# Altium project loz-old-man.PrjPcb (part 3 of 5)

## Sheet POWER.SchDoc
size B; DocumentNumber: 2; SheetNumber: 2; SheetTotal: 14; PAGE_TITLE: -
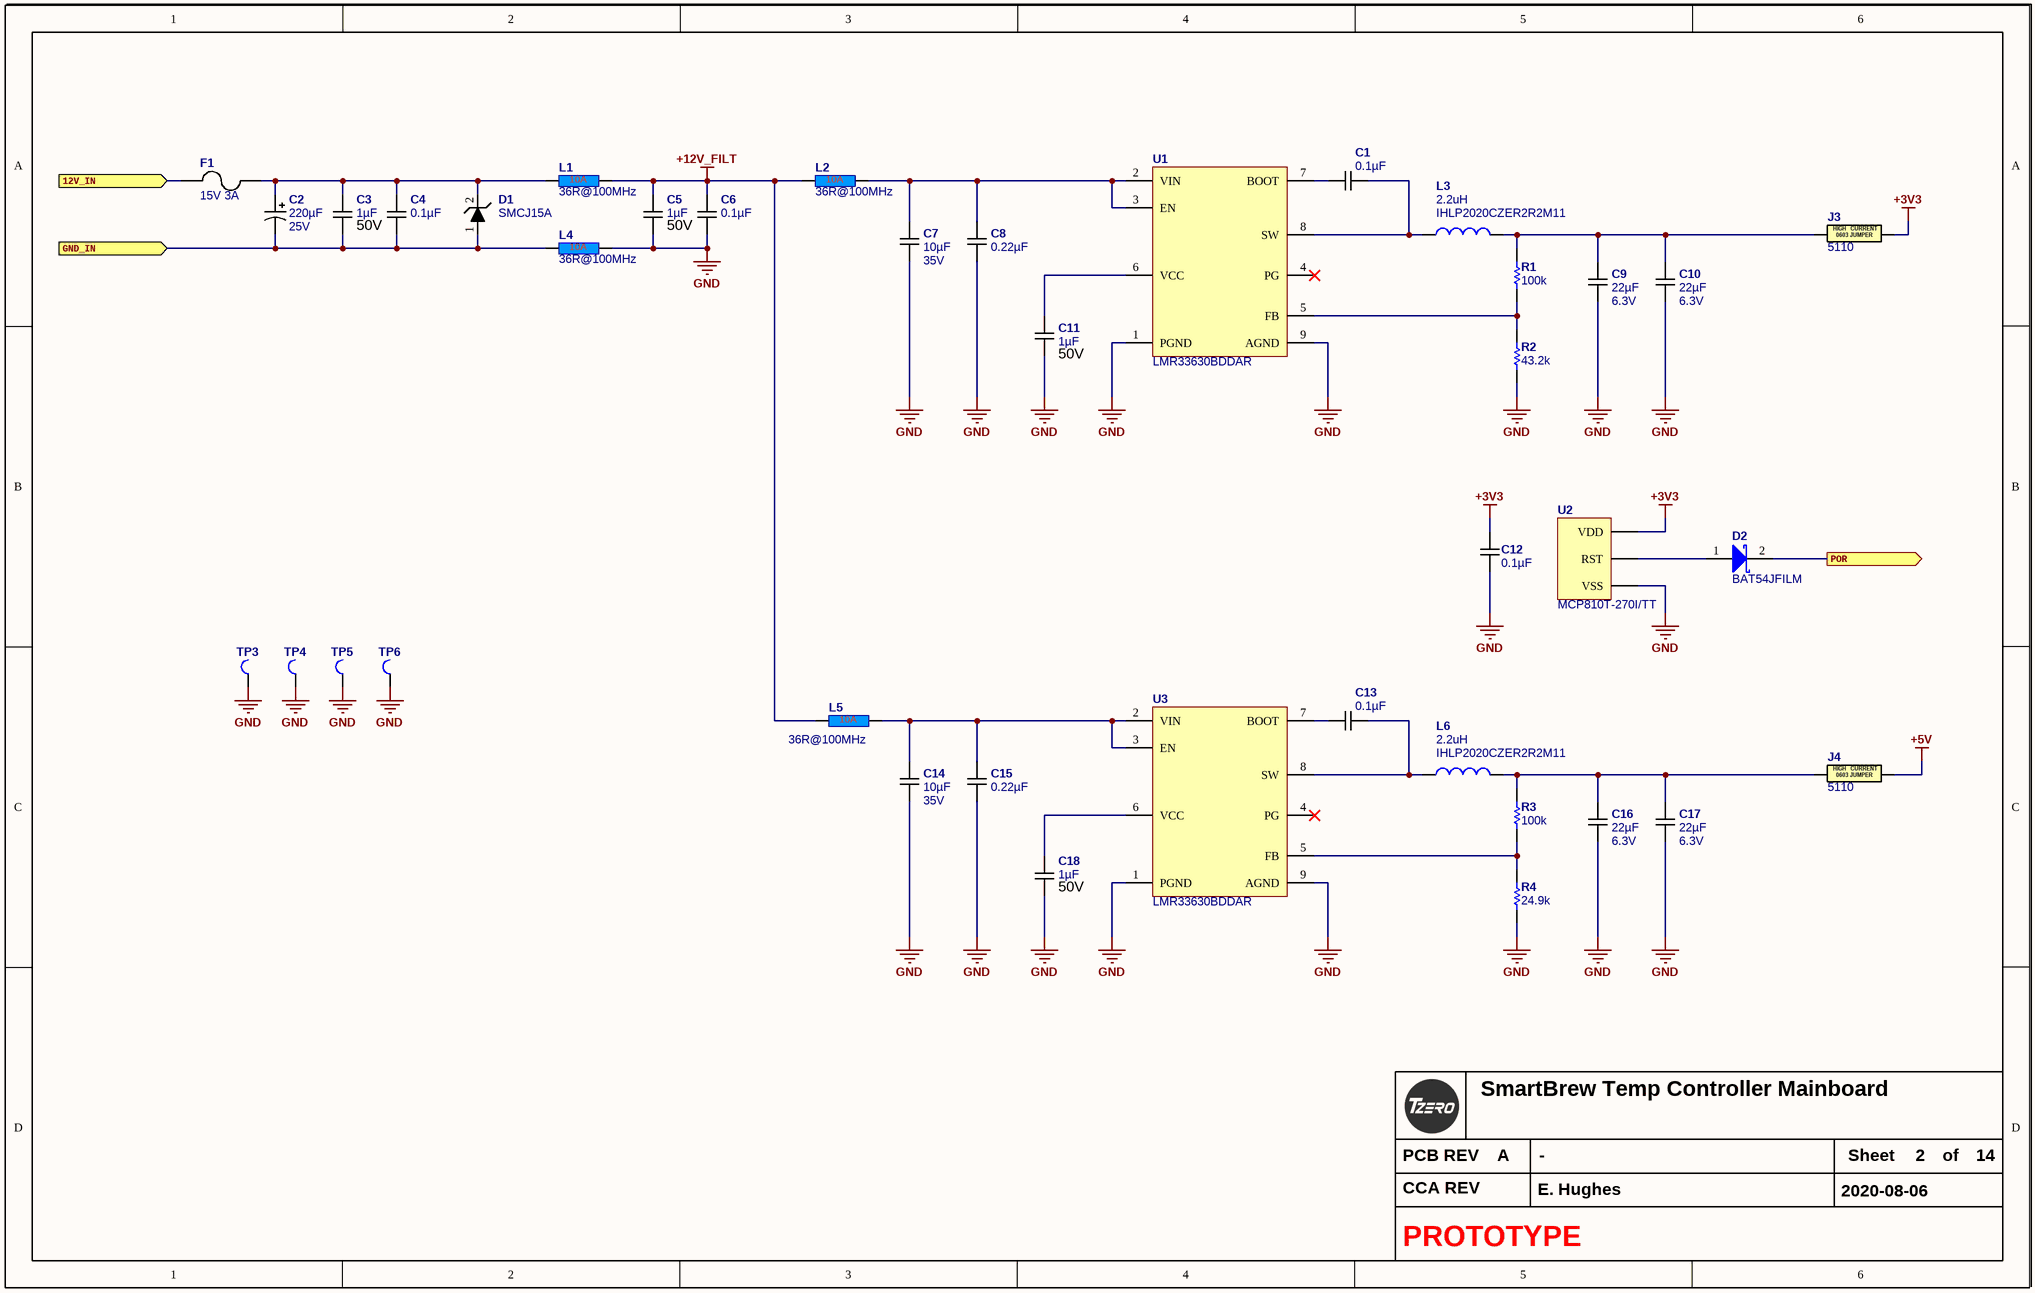
[diagram p6: POWER.SchDoc]

### Parts
C1  0.1µF  [C0402_0.55MM_HD]
C2  220µF  Voltage Rating: 25V  [C_ALU_F]
C3  1µF  Voltage - Rated: 50V  [C0805_1.50MM_MD]
C4  0.1µF  [C0402_0.55MM_HD]
C5  1µF  Voltage - Rated: 50V  [C0805_1.50MM_MD]
C6  0.1µF  [C0402_0.55MM_HD]
C7  10µF  Voltage - Rated: 35V  [C1206_1.90MM_HD]
C8  0.22µF  [C0603_0.90MM_HD]
C9  22µF  Voltage - Rated: 6.3V  [C1206_1.60MM_HD]
C10  22µF  Voltage - Rated: 6.3V  [C1206_1.60MM_HD]
C11  1µF  Voltage - Rated: 50V  [C0805_1.50MM_MD]
C12  0.1µF  [C0402_0.55MM_HD]
C13  0.1µF  [C0402_0.55MM_HD]
C14  10µF  Voltage - Rated: 35V  [C1206_1.90MM_HD]
C15  0.22µF  [C0603_0.90MM_HD]
C16  22µF  Voltage - Rated: 6.3V  [C1206_1.60MM_HD]
C17  22µF  Voltage - Rated: 6.3V  [C1206_1.60MM_HD]
C18  1µF  Voltage - Rated: 50V  [C0805_1.50MM_MD]
D1  SMCJ15A  [D_SMC_P]
D2  BAT54JFILM  [SOD-323]
F1  15V 3A  [F_PTC_2920]
J3  5110  [C0603_0.9mm]
J4  5110  [C0603_0.9mm]
L1  36R@100MHz  [T_Laird_35F0121-0SR-10]
L2  36R@100MHz  [T_Laird_35F0121-0SR-10]
L3  2.2uH  [IHLP-2020CZ]
L4  36R@100MHz  [T_Laird_35F0121-0SR-10]
L5  36R@100MHz  [T_Laird_35F0121-0SR-10]
L6  2.2uH  [IHLP-2020CZ]
R1  100k  [R0603_0.55MM_MD]
R2  43.2k  [R0603_0.55MM_MD]
R3  100k  [R0603_0.55MM_MD]
R4  24.9k  [R0603_0.55MM_MD]
TP3  PC TEST POINT MINIATURE SMT  [SMT_TEST_5015]  (value not drawn)
TP4  PC TEST POINT MINIATURE SMT  [SMT_TEST_5015]  (value not drawn)
TP5  PC TEST POINT MINIATURE SMT  [SMT_TEST_5015]  (value not drawn)
TP6  PC TEST POINT MINIATURE SMT  [SMT_TEST_5015]  (value not drawn)
U1  LMR33630BDDAR  [HSOIC-8]
U2  MCP810T-270I/TT  [SOT23_Medium]
U3  LMR33630BDDAR  [HSOIC-8]

### Ports
12V_IN (in), GND_IN (in), POR (out)

### Nets
+3V3: C12.1 J3.2 U2.3(VDD)
+5V: J4.2
+12V_FILT: C5.2 C6.2 L1.2 L2.1 L5.1
GND: C5.1 C6.1 C7.1 C8.1 C9.1 C10.1 C11.1 C12.2 C14.1 C15.1 C16.1 C17.1 C18.1 L4.2 R2.1 R4.1 TP3.1 TP4.1 TP5.1 TP6.1 U1.1(PGND) U1.9(AGND) U2.1(VSS) U3.1(PGND) U3.9(AGND)
12V_IN: F1.1 ; port 12V_IN
GND_IN: C2.2 C3.1 C4.1 D1.1(A) L4.1 ; port GND_IN
POR: D2.2(K) ; port POR
NetC1_1: C1.1 L3.1 U1.8(SW)
NetC1_2: C1.2 U1.7(BOOT)
NetC2_1: C2.1 C3.2 C4.2 D1.2(K) F1.2 L1.1
NetC7_2: C7.2 C8.2 L2.2 U1.2(VIN) U1.3(EN)
NetC9_2: C9.2 C10.2 J3.1 L3.2 R1.2
NetC11_2: C11.2 U1.6(VCC)
NetC13_1: C13.1 L6.1 U3.8(SW)
NetC13_2: C13.2 U3.7(BOOT)
NetC14_2: C14.2 C15.2 L5.2 U3.2(VIN) U3.3(EN)
NetC16_2: C16.2 C17.2 J4.1 L6.2 R3.2
NetC18_2: C18.2 U3.6(VCC)
NetD2_1: D2.1(A) U2.2(RST)
NetR1_1: R1.1 R2.2 U1.5(FB)
NetR3_1: R3.1 R4.2 U3.5(FB)

Not connected (* = marked no-connect by the designer): U1 4(PG)*; U3 4(PG)*

### Notes on the sheet
- PCB REV
- Sheet
- of
- CCA REV
- (in symbol 5110) HIGH; CURRENT; 0603 JUMPER

### Library data of the parts
C1 C4 C6 C12 C13 = CGA2B3X7R1E104K050BB: CAP CER 0.1UF 25V X7R 0402; Manufacturer: TDK Corporation; Tolerance: ±10%; Substitution Notes: 0.1µF , 25V , ±10% , X7R , -55°C ~ 125°C , AEC-Q200 , 0402; Value: 0.1µF; Temperature Coefficient: X7R; Manufacturer Part Number: CGA2B3X7R1E104K050BB; ComponentLink1Description: Datasheet (Internal); ComponentLink1URL: datasheets\TDK\mlcc_automotive_general_en.pdf; ComponentLink2Description: Datasheet (External); ComponentLink2URL: https://product.tdk.com/info/en/catalog/datasheets/mlcc_automotive_general_en.pdf; Supplier 1: Digikey; Supplier Part Number 1: 445-6902-1-ND; Category: Capacitors; Voltage - Rated: 25V; Features: -; Operating Temperature: -55°C ~ 125°C; Ratings: AEC-Q200; Package: 0402; Thickness (Max): 0.55MM
C2 = EEE-FK1E221P: CAP ALUM 220UF 25V 20% SMD; Manufacturer: Panasonic Electronic Components; Lifetime @ Temp#: 2000 Hrs @ 105°C; Ripple Current: 600mA; Impedance: 160 mOhm; Surface Mount Land Size: 0.327" L x 0.327" W (8.30mm x 8.30mm); Value_Voltage: 220µF  25V; Value: 220µF; Temperature Coefficient: Temperature Coefficient; Manufacturer Part Number: EEE-FK1E221P; ComponentLink1Description: Internal Datasheet; ComponentLink1URL: http://industrial.panasonic.com/www-cgi/jvcr13pz.cgi?E+PZ+3+ABA0120+EEEFK1E221P+7+WW; ComponentLink2Description: External Datasheet; ComponentLink2URL: http://industrial.panasonic.com/www-cgi/jvcr13pz.cgi?E+PZ+3+ABA0120+EEEFK1E221P+7+WW; Supplier 1: Digi-Key; Supplier Part Number 1: PCE3800CT-ND; Category: Capacitors; Sort Value: 220000000; Sort Value Package: F_220000000; Capacitance: 220µF; Tolerance: ±20%; Operating Temperature: -55°C ~ 105°C; Features: General Purpose; ESR (Equivalent Series Resistance): -; Mounting Type: Surface Mount; Package / Case: Radial- Can - SMD; Size / Dimension: 0.315" Dia (8.00mm); Height - Seated (Max): 0.402" (10.20mm); Lead Spacing: -; Packaging: Cut Tape (CT); Diameter: 8.00; Height: 10.20; Package: F; Ratings: AEC-Q200
C3 C5 C11 C18 = CGA4J3X7R1H105M125AE: CAP CER 1UF 50V X7R 0805; Manufacturer: TDK Corporation; Tolerance: ±20%; Substitution Notes: 1µF , 50V , ±20% , X7R , -55°C ~ 125°C , AEC-Q200 , 0805; Value: 1µF; Temperature Coefficient: X7R; Manufacturer Part Number: CGA4J3X7R1H105M125AE; ComponentLink1Description: Datasheet (Internal); ComponentLink1URL: datasheets\TDK\mlcc_automotive_general_en.pdf; ComponentLink2Description: Datasheet (External); ComponentLink2URL: https://product.tdk.com/info/en/catalog/datasheets/mlcc_automotive_general_en.pdf; Supplier 1: Digikey; Supplier Part Number 1: 445-7958-1-ND; Category: Capacitors; Features: Soft Termination; Operating Temperature: -55°C ~ 125°C; Ratings: AEC-Q200; Package: 0805; Thickness (Max): 1.50MM
C7 C14 = CGA5L1X7R1V106M160AE: CAP CER 10UF 35V X7R 1206; Manufacturer: TDK Corporation; Tolerance: ±20%; Substitution Notes: 10µF , 35V , ±20% , X7R ,  , AEC-Q200 , 1206; Value: 10µF; Temperature Coefficient: X7R; Manufacturer Part Number: CGA5L1X7R1V106M160AE; ComponentLink1Description: Datasheet (Internal); ComponentLink1URL: datasheets\TDK\mlcc_automotive_general_en.pdf; ComponentLink2Description: Datasheet (External); ComponentLink2URL: https://product.tdk.com/info/en/catalog/datasheets/mlcc_automotive_general_en.pdf; Supplier 1: Digikey; Supplier Part Number 1: 445-172484-1-ND; Category: Capacitors; Features: Soft Termination; Ratings: AEC-Q200; Package: 1206; Thickness (Max): 1.90MM
C8 C15 = CGA3E3X7R1H224K080AB: CAP CER 0.22UF 50V X7R 0603; Manufacturer: TDK Corporation; Tolerance: ±10%; Substitution Notes: 0.22µF , 50V , ±10% , X7R , -55°C ~ 125°C , AEC-Q200 , 0603; Value: 0.22µF; Temperature Coefficient: X7R; Manufacturer Part Number: CGA3E3X7R1H224K080AB; ComponentLink1Description: Datasheet (Internal); ComponentLink1URL: datasheets\TDK\mlcc_automotive_general_en.pdf; ComponentLink2Description: Datasheet (External); ComponentLink2URL: https://product.tdk.com/info/en/catalog/datasheets/mlcc_automotive_general_en.pdf; Supplier 1: Digikey; Supplier Part Number 1: 445-6926-1-ND; Category: Capacitors; Voltage - Rated: 50V; Features: -; Operating Temperature: -55°C ~ 125°C; Ratings: AEC-Q200; Package: 0603; Thickness (Max): 0.90MM
C9 C10 C16 C17 = CGA5L1X7R0J226M160AC: CAP CER 22UF 6.3V X7R 1206; Manufacturer: TDK Corporation; Tolerance: ±20%; Substitution Notes: 22µF , 6.3V , ±20% , X7R , -55°C ~ 125°C , AEC-Q200 , 1206; Value: 22µF; Temperature Coefficient: X7R; Manufacturer Part Number: CGA5L1X7R0J226M160AC; ComponentLink1Description: Datasheet (Internal); ComponentLink1URL: datasheets\TDK\mlcc_automotive_general_en.pdf; ComponentLink2Description: Datasheet (External); ComponentLink2URL: https://product.tdk.com/info/en/catalog/datasheets/mlcc_automotive_general_en.pdf; Supplier 1: Digikey; Supplier Part Number 1: 445-7884-1-ND; Category: Capacitors; Features: -; Ratings: AEC-Q200; Package: 1206; Thickness (Max): 1.60MM; Operating Temperature: -55°C ~ 125°C
D1 = SMCJ15A: DIODE TVS 15V 1500W UNI 5% SMC; Manufacturer: Littelfuse Inc; CategorySort: 850; Voltage - Breakdown: 16.7V; Polarization: Unidirectional; Diode Suffix: 1A_2C; Category: Circuit Protection; Value: SMCJ15A; Manufacturer Part Number: SMCJ15A; ComponentLink1Description: Internal Datasheet; ComponentLink1URL: http://www.littelfuse.com/data/en/Data_Sheets/Littelfuse_TVS_Diode_SMCJ.pdf; ComponentLink2Description: External Datasheet; ComponentLink2URL: http://www.littelfuse.com/data/en/Data_Sheets/Littelfuse_TVS_Diode_SMCJ.pdf; Supplier 1: Digi-Key; Supplier Part Number 1: SMCJ15ALFCT-ND; SortValue: SMCJ15A; Voltage - Reverse Standoff (Typ): 15V; Power (Watts): 1500W; Mounting Type: Surface Mount; Package: DO-214AB- SMC; Supplier Device Package: SMC; Packaging: Cut Tape (CT)
D2 = BAT54JFILM: DIODE SCHOTTKY 40V 300MA SOD323; Manufacturer: STMicroelectronics; CategorySort: 400; Reverse Recovery Time: 5ns; Peak Non-Repetitive Surge Current: 1A; Element Configuration: Single; Forward Voltage: 900mV; Packaging 1: Tape and Reel; Max Reverse Leakage Current: 1uA; Peak Reverse Current: 100uA; Polarity: Standard; Voltage Rating (DC): 30V; Capacitance: 10pF; Category: Diodes; Value: BAT54JFILM; Supplier 1: Digi-Key; Supplier Part Number 1: 497-7163-1-ND; Manufacturer Part Number: BAT54JFILM; Stock 1: 46673; Pricing 1: 1=0.36000, 10=0.29200, 100=0.11960, 500=0.09978, 1000=0.06933 (USD); RoHS: Yes; Mount: Surface Mount; Case/Package: SC; Number of Pins: 2; Weight: 0.01lb; Contact Plating: Tin,Matte; Min Operating Temperature: -40°C; Max Operating Temperature: 150°C; Forward Current: 300mA; Max Repetitive Reverse Voltage (Vrrm): 40V; Max Surge Current: 1A; Package Quantity: 1; Recovery Time: 5ns; Average Rectified Current: 300mA; Max Forward Surge Current (Ifsm): 1A; Termination: SMD/SMT; Output Current: 300mA; Current Rating: 300mA; Max Reverse Voltage (DC): 40V; Length: 1.8mm; Height: 1.07mm; Width: 1.45mm; Radiation Hardening: No; REACH SVHC: No SVHC; Lead Free: Lead Free; ComponentLink1URL: https://datasheet.ciiva.com/1177/1689724-1177952.pdf?src-supplier=Element14; ComponentLink1Description: https://datasheet.ciiva.com/1177/1689724-1177952.pdf?src-supplier=Element14; ComponentLink2URL: https://datasheet.ciiva.com/1200/1689724-1200625.pdf?src-supplier=Farnell; ComponentLink2Description: https://datasheet.ciiva.com/1200/1689724-1200625.pdf?src-supplier=Farnell; ComponentLink3URL: https://datasheet.ciiva.com/1200/cd00001322-1200626.pdf?src-supplier=Farnell; ComponentLink3Description: https://datasheet.ciiva.com/1200/cd00001322-1200626.pdf?src-supplier=Farnell; ComponentLink4URL: https://datasheet.ciiva.com/15192/getdatasheetpartid-185078-15192983.pdf?src-supplier=Verical; ComponentLink4Description: https://datasheet.ciiva.com/15192/getdatasheetpartid-185078-15192983.pdf?src-supplier=Verical; ComponentLink5URL: https://datasheet.ciiva.com/915/cd00001322-915529.pdf?src-supplier=Digi-Key; ComponentLink5Description: https://datasheet.ciiva.com/915/cd00001322-915529.pdf?src-supplier=Digi-Key; ComponentLink6URL: https://datasheet.ciiva.com/25954/cd00001322-25954459.pdf?src-supplier=Avnet+Europe; ComponentLink6Description: https://datasheet.ciiva.com/25954/cd00001322-25954459.pdf?src-supplier=Avnet+Europe; ComponentLink7URL: https://datasheet.ciiva.com/1177/1689724-1177950.pdf?src-supplier=Element14; ComponentLink7Description: https://datasheet.ciiva.com/1177/1689724-1177950.pdf?src-supplier=Element14; ComponentLink8URL: https://datasheet.ciiva.com/915/cd00001322-915527.pdf?src-supplier=Digi-Key; ComponentLink8Description: https://datasheet.ciiva.com/915/cd00001322-915527.pdf?src-supplier=Digi-Key; ComponentLink9URL: https://datasheet.ciiva.com/915/cd00001322-915528.pdf?src-supplier=Digi-Key; ComponentLink9Description: https://datasheet.ciiva.com/915/cd00001322-915528.pdf?src-supplier=Digi-Key; ComponentLink10URL: https://datasheet.ciiva.com/1177/1689724-1177951.pdf?src-supplier=Element14; ComponentLink10Description: https://datasheet.ciiva.com/1177/1689724-1177951.pdf?src-supplier=Element14; ComponentLink11URL: https://datasheet.ciiva.com/7622/1689724-7622351.pdf?src-supplier=Element14; ComponentLink11Description: https://datasheet.ciiva.com/7622/1689724-7622351.pdf?src-supplier=Element14
F1 = 2920L300/15DR: PTC RESETTABLE 15V 3A SMD 2920; Manufacturer: Littelfuse Inc; CategorySort: 850; Current - Trip (It): 5A; Current - Max: 40A; R Min/Max: 0.015 ~ 0.048 Ohm; Time to Trip: 20s; Current Trip: 3; Value: 15V 3A; Sort Value: *; Category: Circuit Protection; Manufacturer Part Number: 2920L300/15DR; ComponentLink1Description: Internal Datasheet; ComponentLink1URL: http://www.littelfuse.com/data/en/Data_Sheets/Littelfuse_PTC_2920L.pdf; ComponentLink2Description: External Datasheet; ComponentLink2URL: http://www.littelfuse.com/data/en/Data_Sheets/Littelfuse_PTC_2920L.pdf; Supplier 1: Digi-Key; Supplier Part Number 1: F2875CT-ND; SortValue: 15_3; Current - Hold (Ih) (Max): 3A; Voltage - Max: 15V; Package: 2920 (7351 Metric)- Concave; Packaging: Cut Tape (CT); Footprint: 2920
J3 J4 = 5110: 0603 Solid High Current Jumper; Manufacturer: Keystone Electronics; Resistance (Ohms): 0.0; Power (Watts): 0.5W, 1/2W; Supplier 1: Digi-Key; Supplier Part Number 1: 36-5110CT-ND; Manufacturer Part Number: 5110; RoHS: RoHS Compliant; Category: 5110; Stock 1: 23484; Pricing 1: 1=0.41, 10=0.384, 50=0.28, 100=0.2691, 250=0.24164, 500=0.23066 (USD); Packaging: Cut Tape (CT); Tolerance: Jumper; Composition: Thick Film; Features: -; Temperature Coefficient: -; Operating Temperature: -; Package / Case: 0603 (1608 Metric); Supplier Device Package: 0603; Size / Dimension: 0.061" L x 0.033" W (1.55mm x 0.85mm); Height: 0.028" (0.70mm); Number of Terminations: 2; ComponentLink1URL: http://www.keyelco.com/product-pdf.cfm?p=14038; ComponentLink1Description: http://www.keyelco.com/product-pdf.cfm?p=14038; Value: 5110
L1 L2 L4 L5 = 35F0121-0SR-10: Power Supply FB 10A; Manufacturer Name: Laird; Manufacturer: Laird Steward; Tolerance: 25%; Core Material: Ferrite; Impedance: 41R; Resistance: 42R; Number of Lines: 1; DC Resistance (DCR): 0.75mR; Test Frequency: 100MHz; Frequency: 10MHz; Rating: 10A; Manufacturer Part No.: 35F0121-0SR-10; Supplier 1: Digi-Key; Supplier Part Number 1: 240-2520-1-ND; Manufacturer Part Number: 35F0121-0SR-10; Stock: 289479; Pricing: 1 = 0.29000, 10 = 0.22600, 25 = 0.18760, 50 = 0.16160, 100 = 0.14540, 250 = 0.12280, 500 = 0.10988, 1000 = 0.09371 (USD); Mount: Surface Mount; Case/Package: SMD/SMT; Weight: 0.00512oz; Case Code (Metric): 4131; Case Code (Imperial): 1612; Min Operating Temperature: -40°C; Max Operating Temperature: 125°C; Package Quantity: 2500; Packaging: Tape and Reel; Max Current Rating: 10A; Max DC Current: 10A; Termination: SMD/SMT; Length: 0.16inch; Height: 0.12inch; Width: 0.12inch; Depth: 3.05mm; Lead Free: Lead Free; ComponentLink1URL: http://lairdtech.thomasnet.com/Asset/35F0121-0SR-10-C-2-VP.pdf; ComponentLink1Description: http://lairdtech.thomasnet.com/Asset/35F0121-0SR-10-C-2-VP.pdf; ComponentLink2URL: http://datasheet.octopart.com/35F0121-0SR-10-Steward-datasheet-65778.pdf; ComponentLink2Description: http://datasheet.octopart.com/35F0121-0SR-10-Steward-datasheet-65778.pdf; ComponentLink3URL: http://datasheet.octopart.com/35F0121-0SR-10-Steward-datasheet-153820.pdf; ComponentLink3Description: http://datasheet.octopart.com/35F0121-0SR-10-Steward-datasheet-153820.pdf; ComponentLink4URL: http://datasheet.octopart.com/35F0121-0SR-10-Steward-datasheet-14434158.pdf; ComponentLink4Description: http://datasheet.octopart.com/35F0121-0SR-10-Steward-datasheet-14434158.pdf; Value: 36R@100MHz
L3 L6 = IHLP2020CZER2R2M11: FIXED IND 2.2UH 6.75A 25 MOHM; Manufacturer: Vishay Dale; CategorySort: 300; Core Material: Metal,Composite; Tolerance: 20%; DC Resistance (DCR): 25mR; Packaging 1: Tape and Reel; Saturation Current: 5.5A; Shielding: Shielded; Self Resonant Frequency: 41MHz; Test Frequency: 100kHz; Category: INDUCTOR; Value: 2.2uH; Supplier 1: Digi-Key; Supplier Part Number 1: 541-1236-1-ND; Manufacturer Part Number: IHLP2020CZER2R2M11; Stock 1: 63099; Pricing 1: 1=2.39000, 10=2.20800, 100=1.54560, 500=1.25120, 1000=1.14080 (USD); RoHS: Yes; Mount: Surface Mount; Case/Package: 2020; Contact Plating: Tin; Min Operating Temperature: -55°C; Max Operating Temperature: 125°C; Inductance: 2.2uH; Inductance Tolerance: 20%; Package Quantity: 2000; Current Rating: 6.75A; Max DC Current: 5.5A; Termination: SMD/SMT; RMS Current (Irms): 6.75A; Military Standard: Not; Length: 5.74mm; Height: 3mm; Depth: 5.43mm; Width: 0.204inch; Height - Seated (Max): 0.118inch; Radiation Hardening: No; REACH SVHC: Unknown; Lead Free: Lead Free; ComponentLink1URL: https://datasheet.ciiva.com/11798/0900766b8102c930-11798352.pdf?src-supplier=RSComponents; ComponentLink1Description: https://datasheet.ciiva.com/11798/0900766b8102c930-11798352.pdf?src-supplier=RSComponents; ComponentLink2URL: https://datasheet.ciiva.com/1051/lp20cz11-1051642.pdf?src-supplier=Digi-Key; ComponentLink2Description: https://datasheet.ciiva.com/1051/lp20cz11-1051642.pdf?src-supplier=Digi-Key; ComponentLink3URL: https://datasheet.ciiva.com/1051/lp20cz11-1051643.pdf?src-supplier=Digi-Key; ComponentLink3Description: https://datasheet.ciiva.com/1051/lp20cz11-1051643.pdf?src-supplier=Digi-Key; ComponentLink4URL: https://datasheet.ciiva.com/17269/lp20cz11-17269547.pdf?src-supplier=Avnet+Europe; ComponentLink4Description: https://datasheet.ciiva.com/17269/lp20cz11-17269547.pdf?src-supplier=Avnet+Europe; ComponentLink5URL: https://datasheet.ciiva.com/1051/lp20cz11-1051644.pdf?src-supplier=Digi-Key; ComponentLink5Description: https://datasheet.ciiva.com/1051/lp20cz11-1051644.pdf?src-supplier=Digi-Key; ComponentLink6URL: https://datasheet.ciiva.com/24205/lp20cz11-24205966.pdf?src-supplier=Future+Electronics; ComponentLink6Description: https://datasheet.ciiva.com/24205/lp20cz11-24205966.pdf?src-supplier=Future+Electronics; ComponentLink7URL: https://datasheet.ciiva.com/46385/480942-46385615.pdf?src-supplier=Element14; ComponentLink7Description: https://datasheet.ciiva.com/46385/480942-46385615.pdf?src-supplier=Element14
R1 R3 = ERJ-3EKF1003V: RES 100K OHM 1/10W 1% 0603 SMD; Manufacturer: Panasonic Electronic Components; Package Power: 0603  (0.1W); Power (Watts): 0.1W- 1/10W; Temperature Coefficient: ±100ppm/°C; Limiting Element Voltage: 75; Maximum Overload Voltage: 150; Maximum Working Voltage: 75.0V; Substitution Notes: 100k , ±1% , 0603 , AEC-Q200; Value: 100k; Manufacturer Part Number: ERJ-3EKF1003V; ComponentLink1Description: Internal Datasheet; ComponentLink1URL: datasheets\Panasonic Electronic Components\AOA0000CE2.pdf; ComponentLink2Description: External Datasheet; ComponentLink2URL: http://industrial.panasonic.com/www-data/pdf/AOA0000/AOA0000CE2.pdf; Supplier 1: Digi-Key; Supplier Part Number 1: P100KHCT-ND; Category: Resistors; Resistance (Ohms): 100k; Composition: Thick Film; Features: -; Tolerance: ±1%; Package: 0603 (1608 Metric); Supplier Package: 0603; Size / Dimension: 0.063" L x 0.031" W (1.60mm x 0.80mm); Height: 0.55MM; Number of Terminations: 2; Packaging: Cut Tape (CT); Sort Value: 100000; Sort Value Package: 603_100000; Ratings: AEC-Q200
R2 = ERJ-3EKF4322V: RES 43.2K OHM 1/10W 1% 0603 SMD; Manufacturer: Panasonic Electronic Components; Package Power: 0603  (0.1W); Power (Watts): 0.1W- 1/10W; Temperature Coefficient: ±100ppm/°C; Limiting Element Voltage: 75; Maximum Overload Voltage: 150; Maximum Working Voltage: 65.7V; Substitution Notes: 43.2k , ±1% , 0603 , AEC-Q200; Value: 43.2k; Manufacturer Part Number: ERJ-3EKF4322V; ComponentLink1Description: Internal Datasheet; ComponentLink1URL: datasheets\Panasonic Electronic Components\AOA0000CE2.pdf; ComponentLink2Description: External Datasheet; ComponentLink2URL: http://industrial.panasonic.com/www-data/pdf/AOA0000/AOA0000CE2.pdf; Supplier 1: Digi-Key; Supplier Part Number 1: P43.2KHCT-ND; Category: Resistors; Resistance (Ohms): 43.2k; Composition: Thick Film; Features: -; Tolerance: ±1%; Package: 0603 (1608 Metric); Supplier Package: 0603; Size / Dimension: 0.063" L x 0.031" W (1.60mm x 0.80mm); Height: 0.55MM; Number of Terminations: 2; Packaging: Cut Tape (CT); Sort Value: 43200; Sort Value Package: 603_43200; Ratings: AEC-Q200
R4 = ERJ-3EKF2492V: RES 24.9K OHM 1/10W 1% 0603 SMD; Manufacturer: Panasonic Electronic Components; Package Power: 0603  (0.1W); Power (Watts): 0.1W- 1/10W; Temperature Coefficient: ±100ppm/°C; Limiting Element Voltage: 75; Maximum Overload Voltage: 150; Maximum Working Voltage: 49.9V; Substitution Notes: 24.9k , ±1% , 0603 , AEC-Q200; Value: 24.9k; Manufacturer Part Number: ERJ-3EKF2492V; ComponentLink1Description: Internal Datasheet; ComponentLink1URL: datasheets\Panasonic Electronic Components\AOA0000CE2.pdf; ComponentLink2Description: External Datasheet; ComponentLink2URL: http://industrial.panasonic.com/www-data/pdf/AOA0000/AOA0000CE2.pdf; Supplier 1: Digi-Key; Supplier Part Number 1: P24.9KHCT-ND; Category: Resistors; Resistance (Ohms): 24.9k; Composition: Thick Film; Features: -; Tolerance: ±1%; Package: 0603 (1608 Metric); Supplier Package: 0603; Size / Dimension: 0.063" L x 0.031" W (1.60mm x 0.80mm); Height: 0.55MM; Number of Terminations: 2; Packaging: Cut Tape (CT); Sort Value: 24900; Sort Value Package: 603_24900; Ratings: AEC-Q200
TP3-TP6 = 5015: Manufacturer: Keystone Electronics; Manufacturer Part Number: 5015; ROHS Certificate: *; Value: PC TEST POINT MINIATURE SMT; Pricing: *; Supplier 1: Digi-Key; Supplier Part Number 1: 36-5015CT-ND; RoHS: RoHS Compliant; Category: Test and Measurement; Type: PC Test Point, Miniature; Terminal: 0.010" (0.25mm) Phosphor Bronze, Silver Plate; Mounting Type: Surface Mount; Material: Phosphor Bronze; Color: -; Packaging: Cut Tape (CT); ComponentLink1URL: http://mail.keyelco.com/ENG._DEPT/PDF%20CAT%20NO%20Drawings/5015.pdf; ComponentLink1Description: http://mail.keyelco.com/ENG._DEPT/PDF%20CAT%20NO%20Drawings/5015.pdf
U1 U3 = LMR33630BDDAR: SIMPLE SWITCHER® 3.8V to 36V, 3A Synchronous Buck Converter With Ultra-Low EMI 8-SO PowerPAD -40 to 125; Manufacturer: Texas Instruments; CategorySort: 600; Output Type: Adjustable; Packaging 1: Tape and Reel; Output Configuration: Positive; Number of Outputs: 1; Min Output Voltage: 1V; Max Output Voltage: 24V; Switching Frequency: 1.4MHz; Synchronous Rectifier: Yes; Category: Integrated Circuits; Value: LMR33630BDDAR; Supplier 1: Digi-Key; Supplier Part Number 1: 296-49765-1-ND; Manufacturer Part Number: LMR33630BDDAR; Stock 1: 1151; Pricing 1: 1=2.21000, 10=1.98800, 25=1.87520, 100=1.50000, 250=1.31252, 500=1.27500, 1000=1.01250 (USD); RoHS: No; Mount: Surface Mount; Number of Pins: 8; Min Operating Temperature: -40°C; Max Operating Temperature: 125°C; Min Input Voltage: 3.8V; Max Input Voltage: 36V; Output Current: 3A; ComponentLink1URL: http://www.ti.com/lit/ds/symlink/lmr33630.pdf?src-supplier=Digi-Key; ComponentLink1Description: http://www.ti.com/lit/ds/symlink/lmr33630.pdf?src-supplier=Digi-Key; ComponentLink2URL: http://www.ti.com/general/docs/suppproductinfo.tsp?distId=10&amp;gotoUrl=http%3A%2F%2Fwww.ti.com%2Flit%2Fgpn%2Flmr33630&src-supplier=Digi-Key; ComponentLink2Description: http://www.ti.com/general/docs/suppproductinfo.tsp?distId=10&amp;gotoUrl=http%3A%2F%2Fwww.ti.com%2Flit%2Fgpn%2Flmr33630&src-supplier=Digi-Key
U2 = MCP810T-270I/TT: IC SUPERVISOR 2.70V HIGH SOT23; Manufacturer: Microchip Technology; Number of Voltages Monitored: 1; Output: Push-Pull, Totem Pole; Reset: Active High; Reset Timeout: 150 ms Minimum; Voltage - Threshold: 2.625V; CategorySort: 600; Value: MCP810T-270I/TT; Sort Value: *; Category: Integrated Circuits; Supplier 1: Digi-Key; Supplier Part Number 1: MCP810T-270I/TTCT-ND; Manufacturer Part Number: MCP810T-270I/TT; RoHS: RoHS Compliant; Stock 1: 6831; Pricing 1: 1=0.54, 10=0.45, 25=0.37, 100=0.34 (USD); Type: Simple Reset/Power-On Reset; Operating Temperature: -40°C ~ 85°C; Mounting Type: Surface Mount; Package: SOT-23-3, TO-236-3, Micro3™, SSD3, SST3; Packaging: Cut Tape (CT); Supplier Device Package: *; ComponentLink1URL: http://ww1.microchip.com/downloads/en/DeviceDoc/11194c.pdf; ComponentLink1Description: http://ww1.microchip.com/downloads/en/DeviceDoc/11194c.pdf

## Sheet RAM.SchDoc
size B; Organization: Pyrotechnics Management Inc.; DocumentNumber: 10; SheetNumber: 10; SheetTotal: 14; PageSetup: Record=PageOptions|CenterHorizontal=True|CenterVertical=True|PrintScale=0.99|XCorrection=1.00|YCorrection=1.00|PrintKind=1|BorderSize=5000000|LeftOffset=0|BottomOffset=0|Orientation=2|PaperLength=1000|PaperWidth=1000|Scale=100|PaperSource=7|PrintQuality=-4|MediaType=1|DitherType=10|PaperKind=Tabloid (11 x 17")|PrintScaleMode=1; SCHEMATIC_SHEET_TITLE: RAM; PAGE_TITLE: -
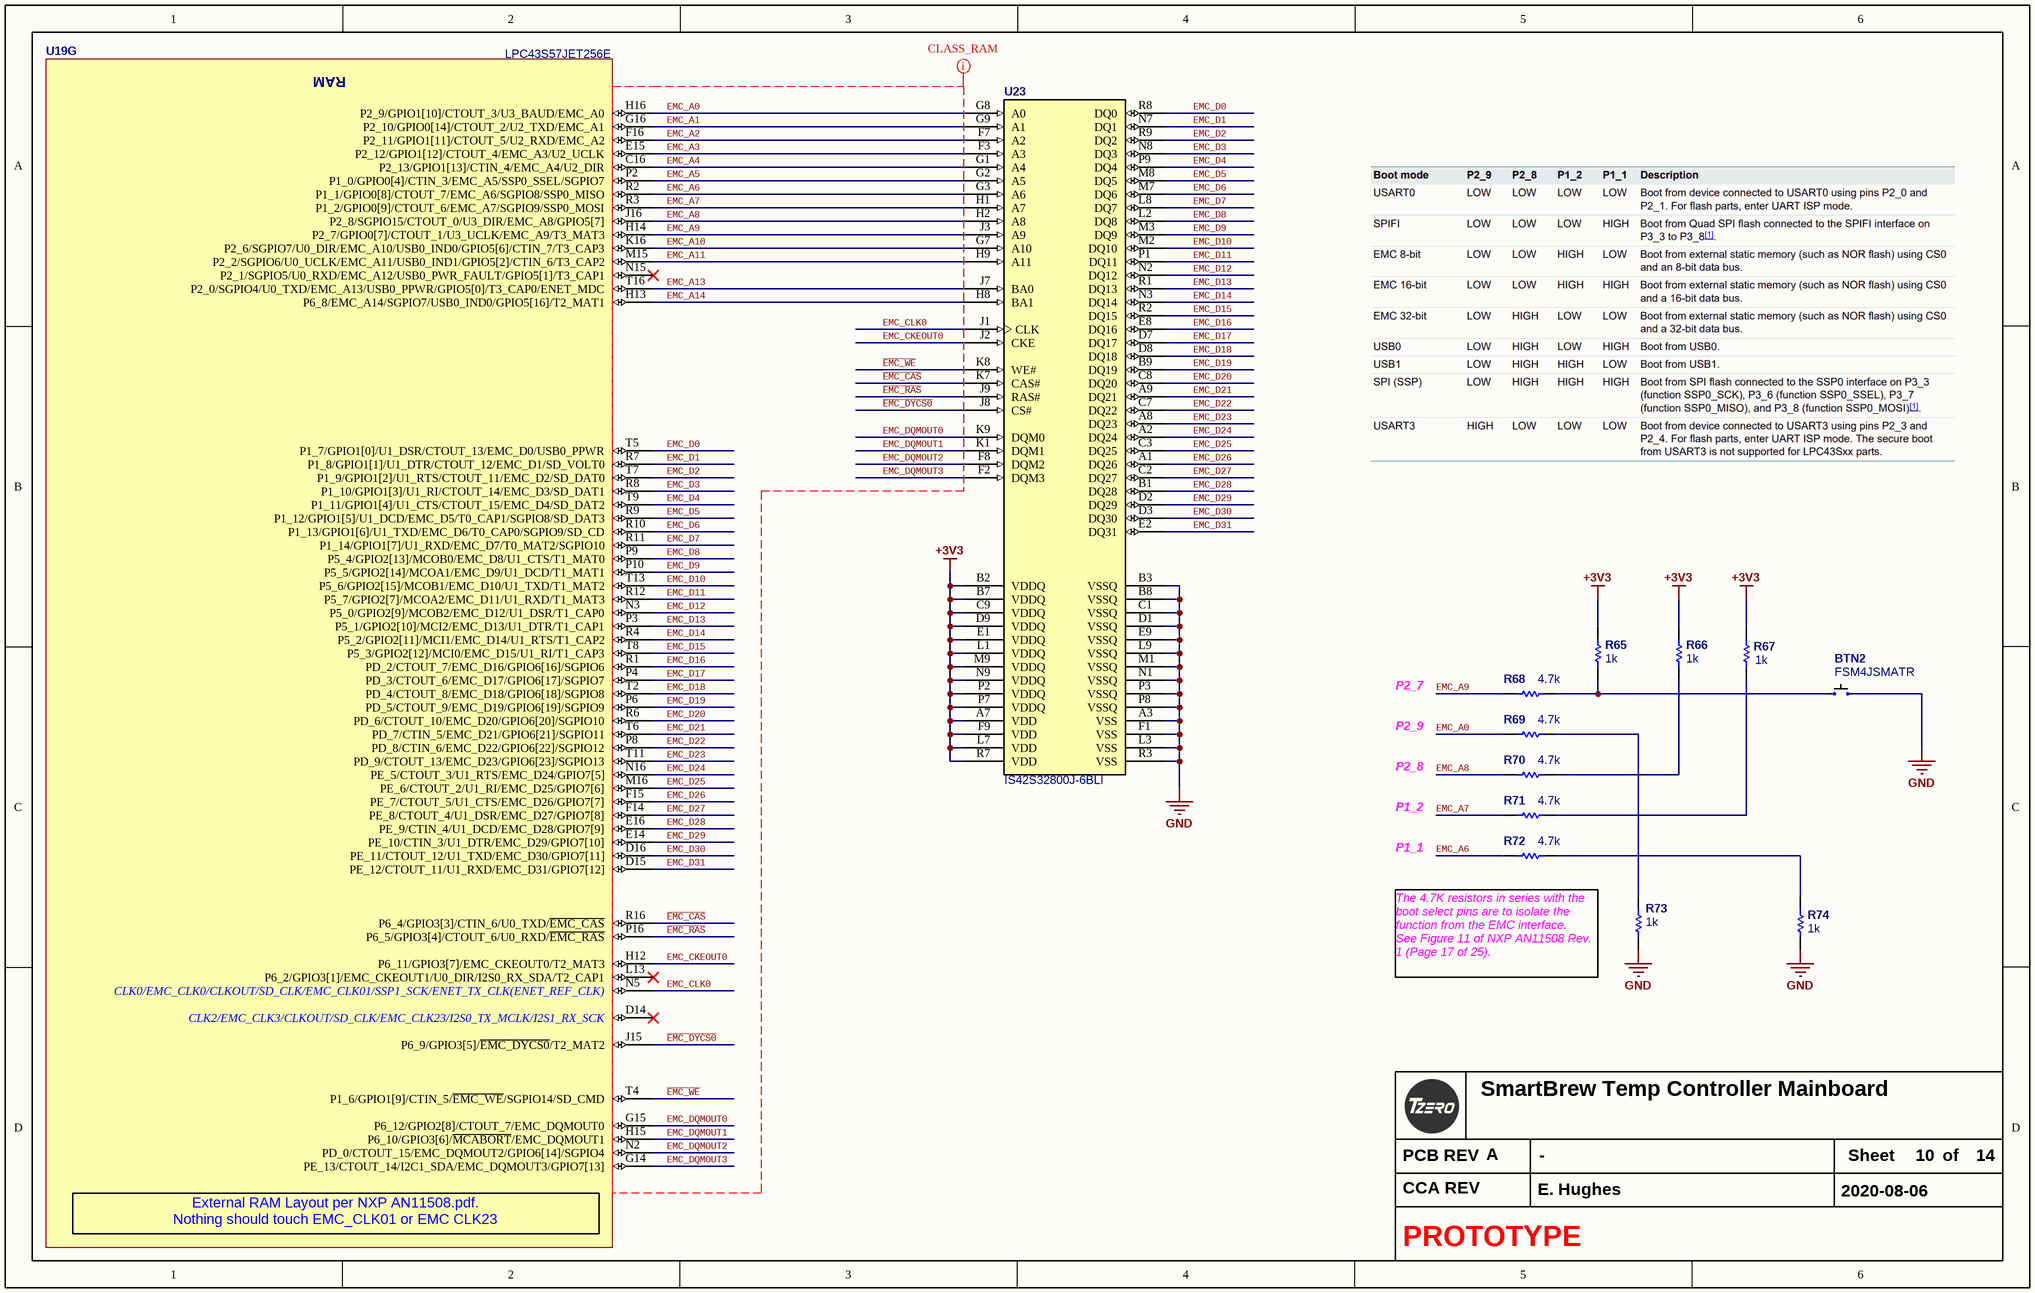
[diagram p7: RAM.SchDoc]

### Parts
BTN2  FSM4JSMATR  [FSM4JSMA]
R65  1k  [R0603_0.55MM_MD]
R66  1k  [R0603_0.55MM_MD]
R67  1k  [R0603_0.55MM_MD]
R68  4.7k  [R0603_0.55MM_MD]
R69  4.7k  [R0603_0.55MM_MD]
R70  4.7k  [R0603_0.55MM_MD]
R71  4.7k  [R0603_0.55MM_MD]
R72  4.7k  [R0603_0.55MM_MD]
R73  1k  [R0603_0.55MM_MD]
R74  1k  [R0603_0.55MM_MD]
U19  LPC43S57JET256E  [LBGA256 16X16 1700X1700X155]  (part G of 10)
U23  IS42S32800J-6BLI  [TFBGA90_8x13]

### Nets
+3V3: R65.2 R66.2 R67.2 U23.A7(VDD) U23.B2(VDDQ) U23.B7(VDDQ) U23.C9(VDDQ) U23.D9(VDDQ) U23.E1(VDDQ) U23.F9(VDD) U23.L1(VDDQ) U23.L7(VDD) U23.M9(VDDQ) U23.N9(VDDQ) U23.P2(VDDQ) U23.P7(VDDQ) U23.R7(VDD)
GND: BTN2.B R73.1 R74.1 U23.A3(VSS) U23.B3(VSSQ) U23.B8(VSSQ) U23.C1(VSSQ) U23.D1(VSSQ) U23.E9(VSSQ) U23.F1(VSS) U23.L3(VSS) U23.L9(VSSQ) U23.M1(VSSQ) U23.N1(VSSQ) U23.P3(VSSQ) U23.P8(VSSQ) U23.R3(VSS)
~{EMC_CAS}: U19.R16(P6_4/GPIO3[3]/CTIN_6/U0_TXD/~{EMC_CAS}) U23.K7(CAS#)
~{EMC_DYCS0}: U19.J15(P6_9/GPIO3[5]/~{EMC_DYCS0}/T2_MAT2) U23.J8(CS#)
~{EMC_RAS}: U19.P16(P6_5/GPIO3[4]/CTOUT_6/U0_RXD/~{EMC_RAS}) U23.J9(RAS#)
~{EMC_WE}: U19.T4(P1_6/GPIO1[9]/CTIN_5/~{EMC_WE}/SGPIO14/SD_CMD) U23.K8(WE#)
EMC_A0: R69.2 U19.H16(P2_9/GPIO1[10]/CTOUT_3/U3_BAUD/EMC_A0) U23.G8(A0)
EMC_A1: U19.G16(P2_10/GPIO0[14]/CTOUT_2/U2_TXD/EMC_A1) U23.G9(A1)
EMC_A2: U19.F16(P2_11/GPIO1[11]/CTOUT_5/U2_RXD/EMC_A2) U23.F7(A2)
EMC_A3: U19.E15(P2_12/GPIO1[12]/CTOUT_4/EMC_A3/U2_UCLK) U23.F3(A3)
EMC_A4: U19.C16(P2_13/GPIO1[13]/CTIN_4/EMC_A4/U2_DIR) U23.G1(A4)
EMC_A5: U19.P2(P1_0/GPIO0[4]/CTIN_3/EMC_A5/SSP0_SSEL/SGPIO7) U23.G2(A5)
EMC_A6: R72.2 U19.R2(P1_1/GPIO0[8]/CTOUT_7/EMC_A6/SGPIO8/SSP0_MISO) U23.G3(A6)
EMC_A7: R71.2 U19.R3(P1_2/GPIO0[9]/CTOUT_6/EMC_A7/SGPIO9/SSP0_MOSI) U23.H1(A7)
EMC_A8: R70.2 U19.J16(P2_8/SGPIO15/CTOUT_0/U3_DIR/EMC_A8/GPIO5[7]) U23.H2(A8)
EMC_A9: R68.2 U19.H14(P2_7/GPIO0[7]/CTOUT_1/U3_UCLK/EMC_A9/T3_MAT3) U23.J3(A9)
EMC_A10: U19.K16(P2_6/SGPIO7/U0_DIR/EMC_A10/USB0_IND0/GPIO5[6]/CTIN_7/T3_CAP3) U23.G7(A10)
EMC_A11: U19.M15(P2_2/SGPIO6/U0_UCLK/EMC_A11/USB0_IND1/GPIO5[2]/CTIN_6/T3_CAP2) U23.H9(A11)
EMC_A13: U19.T16(P2_0/SGPIO4/U0_TXD/EMC_A13/USB0_PPWR/GPIO5[0]/T3_CAP0/ENET_MDC) U23.J7(BA0)
EMC_A14: U19.H13(P6_8/EMC_A14/SGPIO7/USB0_IND0/GPIO5[16]/T2_MAT1) U23.H8(BA1)
EMC_CKEOUT0: U19.H12(P6_11/GPIO3[7]/EMC_CKEOUT0/T2_MAT3) U23.J2(CKE)
EMC_CLK0: U19.N5(CLK0/EMC_CLK0/CLKOUT/SD_CLK/EMC_CLK01/SSP1_SCK/ENET_TX_CLK(ENET_REF_CLK)) U23.J1(CLK)
EMC_D0: U19.T5(P1_7/GPIO1[0]/U1_DSR/CTOUT_13/EMC_D0/USB0_PPWR) U23.R8(DQ0)
EMC_D1: U19.R7(P1_8/GPIO1[1]/U1_DTR/CTOUT_12/EMC_D1/SD_VOLT0) U23.N7(DQ1)
EMC_D2: U19.T7(P1_9/GPIO1[2]/U1_RTS/CTOUT_11/EMC_D2/SD_DAT0) U23.R9(DQ2)
EMC_D3: U19.R8(P1_10/GPIO1[3]/U1_RI/CTOUT_14/EMC_D3/SD_DAT1) U23.N8(DQ3)
EMC_D4: U19.T9(P1_11/GPIO1[4]/U1_CTS/CTOUT_15/EMC_D4/SD_DAT2) U23.P9(DQ4)
EMC_D5: U19.R9(P1_12/GPIO1[5]/U1_DCD/EMC_D5/T0_CAP1/SGPIO8/SD_DAT3) U23.M8(DQ5)
EMC_D6: U19.R10(P1_13/GPIO1[6]/U1_TXD/EMC_D6/T0_CAP0/SGPIO9/SD_CD) U23.M7(DQ6)
EMC_D7: U19.R11(P1_14/GPIO1[7]/U1_RXD/EMC_D7/T0_MAT2/SGPIO10) U23.L8(DQ7)
EMC_D8: U19.P9(P5_4/GPIO2[13]/MCOB0/EMC_D8/U1_CTS/T1_MAT0) U23.L2(DQ8)
EMC_D9: U19.P10(P5_5/GPIO2[14]/MCOA1/EMC_D9/U1_DCD/T1_MAT1) U23.M3(DQ9)
EMC_D10: U19.T13(P5_6/GPIO2[15]/MCOB1/EMC_D10/U1_TXD/T1_MAT2) U23.M2(DQ10)
EMC_D11: U19.R12(P5_7/GPIO2[7]/MCOA2/EMC_D11/U1_RXD/T1_MAT3) U23.P1(DQ11)
EMC_D12: U19.N3(P5_0/GPIO2[9]/MCOB2/EMC_D12/U1_DSR/T1_CAP0) U23.N2(DQ12)
EMC_D13: U19.P3(P5_1/GPIO2[10]/MCI2/EMC_D13/U1_DTR/T1_CAP1) U23.R1(DQ13)
EMC_D14: U19.R4(P5_2/GPIO2[11]/MCI1/EMC_D14/U1_RTS/T1_CAP2) U23.N3(DQ14)
EMC_D15: U19.T8(P5_3/GPIO2[12]/MCI0/EMC_D15/U1_RI/T1_CAP3) U23.R2(DQ15)
EMC_D16: U19.R1(PD_2/CTOUT_7/EMC_D16/GPIO6[16]/SGPIO6) U23.E8(DQ16)
EMC_D17: U19.P4(PD_3/CTOUT_6/EMC_D17/GPIO6[17]/SGPIO7) U23.D7(DQ17)
EMC_D18: U19.T2(PD_4/CTOUT_8/EMC_D18/GPIO6[18]/SGPIO8) U23.D8(DQ18)
EMC_D19: U19.P6(PD_5/CTOUT_9/EMC_D19/GPIO6[19]/SGPIO9) U23.B9(DQ19)
EMC_D20: U19.R6(PD_6/CTOUT_10/EMC_D20/GPIO6[20]/SGPIO10) U23.C8(DQ20)
EMC_D21: U19.T6(PD_7/CTIN_5/EMC_D21/GPIO6[21]/SGPIO11) U23.A9(DQ21)
EMC_D22: U19.P8(PD_8/CTIN_6/EMC_D22/GPIO6[22]/SGPIO12) U23.C7(DQ22)
EMC_D23: U19.T11(PD_9/CTOUT_13/EMC_D23/GPIO6[23]/SGPIO13) U23.A8(DQ23)
EMC_D24: U19.N16(PE_5/CTOUT_3/U1_RTS/EMC_D24/GPIO7[5]) U23.A2(DQ24)
EMC_D25: U19.M16(PE_6/CTOUT_2/U1_RI/EMC_D25/GPIO7[6]) U23.C3(DQ25)
EMC_D26: U19.F15(PE_7/CTOUT_5/U1_CTS/EMC_D26/GPIO7[7]) U23.A1(DQ26)
EMC_D27: U19.F14(PE_8/CTOUT_4/U1_DSR/EMC_D27/GPIO7[8]) U23.C2(DQ27)
EMC_D28: U19.E16(PE_9/CTIN_4/U1_DCD/EMC_D28/GPIO7[9]) U23.B1(DQ28)
EMC_D29: U19.E14(PE_10/CTIN_3/U1_DTR/EMC_D29/GPIO7[10]) U23.D2(DQ29)
EMC_D30: U19.D16(PE_11/CTOUT_12/U1_TXD/EMC_D30/GPIO7[11]) U23.D3(DQ30)
EMC_D31: U19.D15(PE_12/CTOUT_11/U1_RXD/EMC_D31/GPIO7[12]) U23.E2(DQ31)
EMC_DQMOUT0: U19.G15(P6_12/GPIO2[8]/CTOUT_7/EMC_DQMOUT0) U23.K9(DQM0)
EMC_DQMOUT1: U19.H15(P6_10/GPIO3[6]/~{MCABORT}/EMC_DQMOUT1) U23.K1(DQM1)
EMC_DQMOUT2: U19.N2(PD_0/CTOUT_15/EMC_DQMOUT2/GPIO6[14]/SGPIO4) U23.F8(DQM2)
EMC_DQMOUT3: U19.G14(PE_13/CTOUT_14/I2C1_SDA/EMC_DQMOUT3/GPIO7[13]) U23.F2(DQM3)
NetBTN2_A: BTN2.A R65.1 R68.1
NetR66_1: R66.1 R70.1
NetR67_1: R67.1 R71.1
NetR69_1: R69.1 R73.2
NetR72_1: R72.1 R74.2

Not connected (* = marked no-connect by the designer): U19 D14(CLK2/EMC_CLK3/CLKOUT/SD_CLK/EMC_CLK23/I2S0_TX_MCLK/I2S1_RX_SCK)* L13(P6_2/GPIO3[1]/EMC_CKEOUT1/U0_DIR/I2S0_RX_SDA/T2_CAP1)* N15(P2_1/SGPIO5/U0_RXD/EMC_A12/USB0_PWR_FAULT/GPIO5[1]/T3_CAP1)*

### Layout directives
net class CLASS_RAM: EMC_A0, EMC_A1, EMC_A2, EMC_A3, EMC_A4, EMC_A5, EMC_A6, EMC_A7, EMC_A8, EMC_A9, EMC_A10, EMC_A11, EMC_A13, EMC_A14, EMC_CKEOUT0, EMC_CLK0, EMC_D0, EMC_D1, EMC_D2, EMC_D3, EMC_D4, EMC_D5, EMC_D6, EMC_D7, EMC_D8, EMC_D9, EMC_D10, EMC_D11, EMC_D12, EMC_D13, EMC_D14, EMC_D15, EMC_D16, EMC_D17, EMC_D18, EMC_D19, EMC_D20, EMC_D21, EMC_D22, EMC_D23, EMC_D24, EMC_D25, EMC_D26, EMC_D27, EMC_D28, EMC_D29, EMC_D30, EMC_D31, EMC_DQMOUT0, EMC_DQMOUT1, EMC_DQMOUT2, EMC_DQMOUT3, ~{EMC_CAS}, ~{EMC_DYCS0}, ~{EMC_RAS}, ~{EMC_WE}

### Notes on the sheet
- P2_7
- P2_9
- P2_8
- P1_2
- P1_1
- The 4.7K resistors in series with the boot select pins are to isolate the function from the EMC interface.   See Figure 11 of NXP AN11508 Rev. 1 (Page 17 of 25).
- PCB REV
- Sheet
- of
- CCA REV
- (in symbol LPC43S57JET256E, part G) RAM; External RAM Layout per NXP AN11508.pdf. / Nothing should touch EMC_CLK01 or EMC CLK23

### Library data of the parts
BTN2 = FSM4JSMATR: SWITCH TACTILE SPST-NO 0.05A 12V; Manufacturer: TE Connectivity; Switch Function: Off-Mom; Contact Rating @ Voltage: 0.05A @ 12VDC; Actuator Type: Standard; Actuator Orientation: Top Actuated; Outline: 6.00mm x 6.00mm; Illumination: Non-Illuminated; Operating Force: 160gf; Supplier 1: Digi-Key; Supplier Part Number 1: 450-1759-1-ND; Manufacturer Part Number: FSM4JSMATR; RoHS: RoHS Compliant; Category: Switches; Stock 1: 35617; Pricing 1: 1=0.36, 10=0.34, 25=0.2912, 50=0.2474, 100=0.2377, 250=0.21344, 500=0.20374 (USD); Circuit: SPST-NO; Mounting Type: Surface Mount; Termination Style: Gull Wing; Packaging: Cut Tape (CT); ComponentLink1URL: http://documents.tycoelectronics.com/commerce/DocumentDelivery/DDEController?Action=srchrtrv&DocNm=2-1437565-7&DocType=CD&DocLang=EN; ComponentLink1Description: http://documents.tycoelectronics.com/commerce/DocumentDelivery/DDEController?Action=srchrtrv&DocNm=2-1437565-7&DocType=CD&DocLang=EN; Value: FSM4JSMATR
R65-R67 R73 R74 = ERJ-3EKF1001V: RES 1K OHM 1/10W 1% 0603 SMD; Manufacturer: Panasonic Electronic Components; Power (Watts): 0.1W- 1/10W; Temperature Coefficient: ±100ppm/°C; Package Power: 0603  (0.1W); Limiting Element Voltage: 75; Maximum Overload Voltage: 150; Maximum Working Voltage: 10.0V; Substitution Notes: 1k , ±1% , 0603 , AEC-Q200; Value: 1k; Supplier 1: Digi-Key; Supplier Part Number 1: P1.00KHCT-ND; Manufacturer Part Number: ERJ-3EKF1001V; Category: Resistors; Sort Value: 1000; Composition: Thick Film; Features: -; Tolerance: ±1%; Package: 0603 (1608 Metric); Size / Dimension: 0.063" L x 0.031" W (1.60mm x 0.80mm); Height: 0.55MM; Packaging: Cut Tape (CT); ComponentLink1URL: datasheets\Panasonic Electronic Components\AOA0000CE2.pdf; ComponentLink1Description: Internal Datasheet; ComponentLink2Description: External Datasheet; ComponentLink2URL: http://industrial.panasonic.com/www-data/pdf/AOA0000/AOA0000CE2.pdf; Resistance (Ohms): 1k; Supplier Package: 0603; Number of Terminations: 2; Sort Value Package: 603_1000; Ratings: AEC-Q200
R68-R72 = ERJ-3EKF4701V: RES 4.7K OHM 1/10W 1% 0603 SMD; Manufacturer: Panasonic Electronic Components; Power (Watts): 0.1W- 1/10W; Temperature Coefficient: ±100ppm/°C; Package Power: 0603  (0.1W); Limiting Element Voltage: 75; Maximum Overload Voltage: 150; Maximum Working Voltage: 21.7V; Substitution Notes: 4.7k , ±1% , 0603 , AEC-Q200; Value: 4.7k; Supplier 1: Digi-Key; Supplier Part Number 1: P4.70KHCT-ND; Manufacturer Part Number: ERJ-3EKF4701V; Category: Resistors; Sort Value: 4700; Composition: Thick Film; Features: -; Tolerance: ±1%; Package: 0603 (1608 Metric); Size / Dimension: 0.063" L x 0.031" W (1.60mm x 0.80mm); Height: 0.55MM; Packaging: Cut Tape (CT); ComponentLink1URL: datasheets\Panasonic Electronic Components\AOA0000CE2.pdf; ComponentLink1Description: Internal Datasheet; ComponentLink2Description: External Datasheet; ComponentLink2URL: http://industrial.panasonic.com/www-data/pdf/AOA0000/AOA0000CE2.pdf; Resistance (Ohms): 4.7k; Supplier Package: 0603; Number of Terminations: 2; Sort Value Package: 603_4700; Ratings: AEC-Q200
U19 = LPC43S57JET256E: ARM Microcontrollers - MCU CortexM0/4 32bit 1MB Cortex-M4/M0; Manufacturer: NXP Semiconductors; CategorySort: 600; Data RAM Size: 136 KB; Core: ARM Cortex M4/M0; Maximum Clock Frequency: 204 MHz; On-Chip ADC: Yes; Operating Supply Voltage: 2.2 V to 3.6 V; Processor Series: LPC4357; Product Status: New Technology; Value: LPC43S57JET256E; Sort Value: *; Category: Integrated Circuits; Supplier 1: Digi-Key; Supplier Part Number 1: 568-11712-ND; Manufacturer Part Number: LPC43S57JET256E; RoHS: RoHS Compliant; Stock 1: 108; Pricing 1: 1=14.40, 25=13.31, 100=12.24, 250=11.16, 500=10.43, 1000=9.57 (USD); Package: LBGA-256; Packaging: Tray; Mounting Style: SMD/SMT; Program Memory Size: 1 MB; Data Bus Width: 32 bit; Maximum Operating Temperature: + 85 C; Minimum Operating Temperature: - 40 C; Standard Pack Qty: 90; Tradename: LPC; RoHS - Mouser: Y; Minimum Order Quantity: 1; Reeling: False; ComponentLink1URL: http://www.nxp.com/documents/data_sheet/LPC4357_53_37_33.pdf; ComponentLink1Description: http://www.nxp.com/documents/data_sheet/LPC4357_53_37_33.pdf
U23 = IS42S32800J-6BLI: IC DRAM 256M PARALLEL 90TFBGA; Manufacturer: ISSI; CategorySort: 600; Packaging 1: Tray; Memory Type: RAM,SDRAM; Frequency: 166MHz; Category: Integrated Circuits; Value: IS42S32800J-6BLI; Supplier 1: Digi-Key; Supplier Part Number 1: 706-1451-ND; Manufacturer Part Number: IS42S32800J-6BLI; Stock 1: 49; Pricing 1: 1=8.98000, 10=8.26100, 25=8.08960, 50=8.06100, 100=7.23150, 250=7.01224, 500=6.66904, 1000=6.43545 (USD); RoHS: Yes; Case/Package: TFBGA; Min Operating Temperature: -40°C; Max Operating Temperature: 85°C; Interface: Parallel; ComponentLink1URL: http://www.mouser.com/ds/2/198/42-45S32800J-706492.pdf?src-supplier=Mouser; ComponentLink1Description: http://www.mouser.com/ds/2/198/42-45S32800J-706492.pdf?src-supplier=Mouser; ComponentLink2URL: http://www.issi.com/WW/pdf/42-45S32800J.pdf?src-supplier=Avnet; ComponentLink2Description: http://www.issi.com/WW/pdf/42-45S32800J.pdf?src-supplier=Avnet; ComponentLink3URL: http://www.issi.com/WW/pdf/42-45S32800J.pdf?src-supplier=Digi-Key; ComponentLink3Description: http://www.issi.com/WW/pdf/42-45S32800J.pdf?src-supplier=Digi-Key

## Sheet CAN.SchDoc
size B; Organization: Pyrotechnics Management Inc.; DocumentNumber: 7; SheetNumber: 7; SheetTotal: 14; PageSetup: Record=PageOptions|CenterHorizontal=True|CenterVertical=True|PrintScale=0.99|XCorrection=1.00|YCorrection=1.00|PrintKind=1|BorderSize=5000000|LeftOffset=0|BottomOffset=0|Orientation=2|PaperLength=1000|PaperWidth=1000|Scale=100|PaperSource=7|PrintQuality=-4|MediaType=1|DitherType=10|PaperKind=Tabloid (11 x 17")|PrintScaleMode=1; SCHEMATIC_SHEET_TITLE: CAN INTERFACE; PAGE_TITLE: Top Level
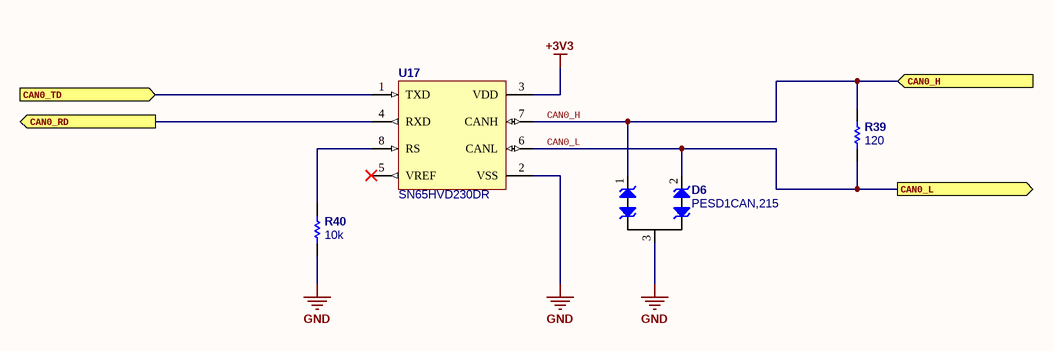
[diagram p8: CAN.SchDoc]

### Parts
D6  PESD1CAN,215  [SOT23_MEDIUM]
R39  120  [R1206_0.70MM_HD]
R40  10k  [R0603_0.55MM_MD]
U17  SN65HVD230DR  [SOIC-8]

### Ports
CAN0_H (in), CAN0_L (out), CAN0_RD (out), CAN0_TD (in)

### Nets
+3V3: U17.3(VDD)
GND: D6.3(A) R40.1 U17.2(VSS)
CAN0_H: D6.1(C1) R39.2 U17.7(CANH) ; port CAN0_H
CAN0_L: D6.2(C2) R39.1 U17.6(CANL) ; port CAN0_L
CAN0_RD: U17.4(RXD) ; port CAN0_RD
CAN0_TD: U17.1(TXD) ; port CAN0_TD
NetR40_2: R40.2 U17.8(RS)

Not connected (* = marked no-connect by the designer): U17 5(VREF)*

### Notes on the sheet
- PCB REV
- Sheet
- of
- CCA REV

### Library data of the parts
D6 = PESD1CAN,215: TVS DIODE 24VWM 70VC SOT23; Manufacturer: NXP Semiconductors; CategorySort: 400; Type: Zener; Bidirectional Channels: 2; Voltage - Reverse Standoff (Typ): 24V (Max); Voltage - Breakdown (Min): 25.4V; Voltage - Clamping (Max) @ Ipp: 70V; Current - Peak Pulse (10/1000µs): 3A (8/20µs); Power - Peak Pulse: 200W; Power Line Protection: No; Capacitance @ Frequency: 11pF @ 1MHz; Value: PESD1CAN,215; Sort Value: *; Category: Diodes; Supplier 1: Digi-Key; Supplier Part Number 1: 568-4032-1-ND; Manufacturer Part Number: PESD1CAN,215; RoHS: RoHS Compliant; Stock 1: 57937; Pricing 1: 1=0.55, 10=0.386, 25=0.3176, 100=0.2537, 250=0.1848, 500=0.15008, 1000=0.11536 (USD); Packaging: Cut Tape (CT); Unidirectional Channels: -; Applications: Automotive; Operating Temperature: -65°C ~ 150°C; Mounting Type: Surface Mount; Package: TO-236-3, SC-59, SOT-23-3; Supplier Device Package: SOT-23-3; ComponentLink1URL: http://www.nxp.com/documents/data_sheet/PESD1CAN.pdf; ComponentLink1Description: http://www.nxp.com/documents/data_sheet/PESD1CAN.pdf; Manufacturer 1: NXP Semiconductors; Manufacturer Part Number 1: PESD1CAN,215
R39 = ERJ-8ENF1200V: RES 120 OHM 1/4W 1% 1206 SMD; Manufacturer: Panasonic Electronic Components; Power (Watts): 0.25W- 1/4W; Temperature Coefficient: ±100ppm/°C; Package Power: 1206  (0.25W); Limiting Element Voltage: 200; Maximum Overload Voltage: 400; Maximum Working Voltage: 5.5V; Substitution Notes: 120 , ±1% , 1206 , AEC-Q200; Value: 120; Supplier 1: Digi-Key; Supplier Part Number 1: P120FCT-ND; Manufacturer Part Number: ERJ-8ENF1200V; Category: Resistors; Sort Value: 120; Composition: Thick Film; Features: -; Tolerance: ±1%; Package: 1206 (3216 Metric); Size / Dimension: 0.126" L x 0.063" W (3.20mm x 1.60mm); Height: 0.70MM; Packaging: Cut Tape (CT); ComponentLink1URL: datasheets\Panasonic Electronic Components\AOA0000CE2.pdf; ComponentLink1Description: Internal Datasheet; ComponentLink2Description: External Datasheet; ComponentLink2URL: http://industrial.panasonic.com/www-data/pdf/AOA0000/AOA0000CE2.pdf; Resistance (Ohms): 120; Supplier Package: 1206; Number of Terminations: 2; Sort Value Package: 1206_120; Ratings: AEC-Q200
R40 = ERJ-3EKF1002V: RES 10K OHM 1/10W 1% 0603 SMD; Manufacturer: Panasonic Electronic Components; Power (Watts): 0.1W- 1/10W; Temperature Coefficient: ±100ppm/°C; Package Power: 0603  (0.1W); Limiting Element Voltage: 75; Maximum Overload Voltage: 150; Maximum Working Voltage: 31.6V; Substitution Notes: 10k , ±1% , 0603 , AEC-Q200; Value: 10k; Supplier 1: Digi-Key; Supplier Part Number 1: P10.0KHCT-ND; Manufacturer Part Number: ERJ-3EKF1002V; Category: Resistors; Sort Value: 10000; Composition: Thick Film; Features: -; Tolerance: ±1%; Package: 0603 (1608 Metric); Size / Dimension: 0.063" L x 0.031" W (1.60mm x 0.80mm); Height: 0.55MM; Packaging: Cut Tape (CT); ComponentLink1URL: datasheets\Panasonic Electronic Components\AOA0000CE2.pdf; ComponentLink1Description: Internal Datasheet; ComponentLink2Description: External Datasheet; ComponentLink2URL: http://industrial.panasonic.com/www-data/pdf/AOA0000/AOA0000CE2.pdf; Resistance (Ohms): 10k; Supplier Package: 0603; Number of Terminations: 2; Sort Value Package: 603_10000; Ratings: AEC-Q200
U17 = SN65HVD230DR: CAN Interface IC STANDBY MODE; Manufacturer: Texas Instruments; CategorySort: 600; Data Rate: 1 Mbps; Operating Supply Voltage: 3.3 V; Supply Voltage - Max: 3.6 V; Supply Voltage - Min: 3 V; Value: SN65HVD230DR; Sort Value: *; Category: Integrated Circuits; Supplier 1: Mouser; Supplier Part Number 1: 595-SN65HVD230DR; Manufacturer Part Number: SN65HVD230DR; RoHS: RoHS Compliant; Stock 1: 6781; Pricing 1: 1=1.95, 10=1.62, 25=1.44, 100=0.972, 250=0.954, 500=0.935, 750=0.917, 2500=0.900 (USD); Package: SOIC-8; Packaging: Reel; Series: SN65HVD230; Type: Transceiver; Mounting Style: SMD/SMT; Maximum Operating Temperature: + 85 C; Minimum Operating Temperature: - 40 C; Product Category: Display Interface; Standard Pack Qty: 2500; RoHS - Mouser: Y; Minimum Order Quantity: 1; Reeling: True; ComponentLink1URL: http://www.ti.com/litv/slos346k; ComponentLink1Description: http://www.ti.com/litv/slos346k